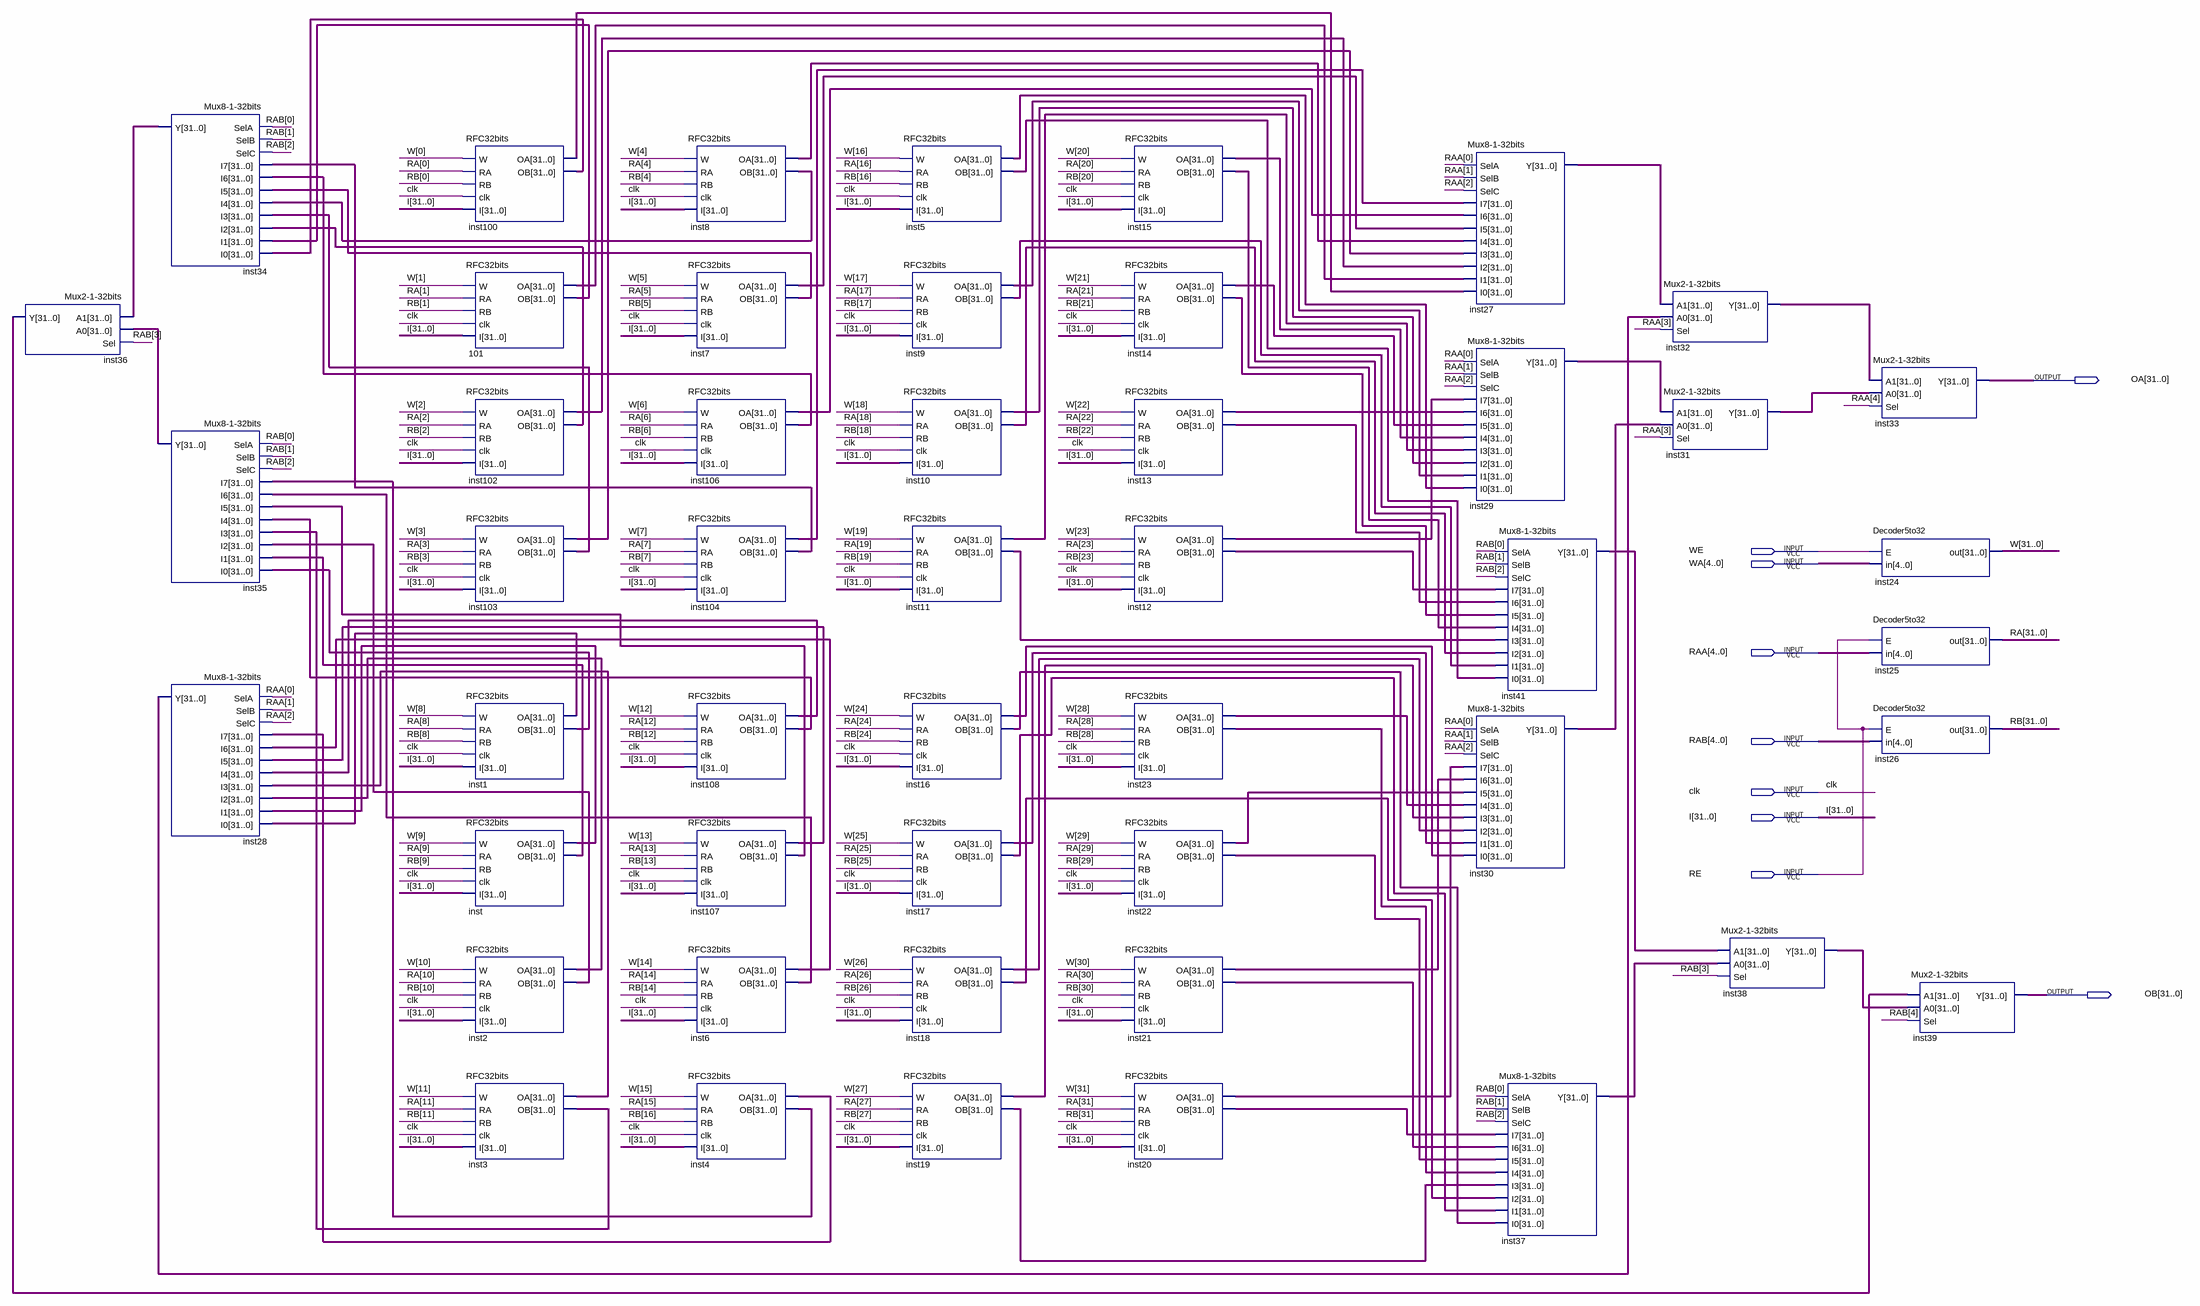
[diagram p0: schematic sheet]
// Quartus schematic RF32-32(test).bdf as structural Verilog: 49 symbols, 9 pins
module \RF32-32(test)  (
  input  WE,
  input  [4:0] WA,
  input  [4:0] RAA,
  input  [4:0] RAB,
  input  clk,
  input  [31:0] I,
  input  RE,
  output [31:0] OA,
  output [31:0] OB
);

  wire [31:0] inst1_oa, inst1_ob, inst2_oa, inst2_ob, inst3_oa, inst3_ob, inst4_oa, inst4_ob, inst5_oa,
       inst5_ob, inst6_oa, inst6_ob, inst7_oa, inst7_ob, inst8_oa, inst8_ob, inst9_oa, inst9_ob, inst10_oa,
       inst10_ob, inst11_oa, inst11_ob, inst12_oa, inst12_ob, inst13_oa, inst13_ob, inst14_oa, inst14_ob,
       inst15_oa, inst15_ob, inst16_oa, inst16_ob, inst17_oa, inst17_ob, inst18_oa, inst18_ob, inst19_oa,
       inst19_ob, inst20_oa, inst20_ob, inst21_oa, inst21_ob, inst22_oa, inst22_ob, inst23_oa, inst23_ob,
       inst27_y, inst28_y, inst29_y, inst30_y, inst31_y, inst32_y, inst34_y, inst35_y, inst36_y, inst37_y,
       inst38_y, inst41_y, inst100_oa, inst100_ob, inst102_oa, inst102_ob, inst103_oa, inst103_ob,
       inst104_oa, inst104_ob, inst106_oa, inst106_ob, inst107_oa, inst107_ob, inst108_oa, inst108_ob,
       inst_oa, inst_ob, n101_oa, n101_ob, RA, RB, W;

  \Mux2-1-32bits  inst36 (.A1(inst34_y), .A0(inst35_y), .Sel(RAB[3]), .Y(inst36_y));
  \Mux8-1-32bits  inst34 (
    .SelA(RAB[0]), .SelB(RAB[1]), .SelC(RAB[2]), .I7(inst104_ob), .I6(inst106_ob), .I5(inst7_ob),
    .I4(inst8_ob), .I3(inst103_ob), .I2(inst102_ob), .I1(n101_ob), .I0(inst100_ob), .Y(inst34_y));
  \Mux8-1-32bits  inst35 (
    .SelA(RAB[0]), .SelB(RAB[1]), .SelC(RAB[2]), .I7(inst4_ob), .I6(inst6_ob), .I5(inst107_ob),
    .I4(inst108_ob), .I3(inst3_ob), .I2(inst2_ob), .I1(inst_ob), .I0(inst1_ob), .Y(inst35_y));
  \Mux8-1-32bits  inst28 (
    .SelA(RAA[0]), .SelB(RAA[1]), .SelC(RAA[2]), .I7(inst4_oa), .I6(inst6_oa), .I5(inst107_oa),
    .I4(inst108_oa), .I3(inst3_oa), .I2(inst2_oa), .I1(inst_oa), .I0(inst1_oa), .Y(inst28_y));
  RFC32bits inst100 (.W(W[0]), .RA(RA[0]), .RB(RB[0]), .clk(clk), .I(I), .OA(inst100_oa), .OB(inst100_ob));
  RFC32bits u_101 (.W(W[1]), .RA(RA[1]), .RB(RB[1]), .clk(clk), .I(I), .OA(n101_oa), .OB(n101_ob));
  RFC32bits inst102 (.W(W[2]), .RA(RA[2]), .RB(RB[2]), .clk(clk), .I(I), .OA(inst102_oa), .OB(inst102_ob));
  RFC32bits inst103 (.W(W[3]), .RA(RA[3]), .RB(RB[3]), .clk(clk), .I(I), .OA(inst103_oa), .OB(inst103_ob));
  RFC32bits inst1 (.W(W[8]), .RA(RA[8]), .RB(RB[8]), .clk(clk), .I(I), .OA(inst1_oa), .OB(inst1_ob));
  RFC32bits inst (.W(W[9]), .RA(RA[9]), .RB(RB[9]), .clk(clk), .I(I), .OA(inst_oa), .OB(inst_ob));
  RFC32bits inst2 (.W(W[10]), .RA(RA[10]), .RB(RB[10]), .clk(clk), .I(I), .OA(inst2_oa), .OB(inst2_ob));
  RFC32bits inst3 (.W(W[11]), .RA(RA[11]), .RB(RB[11]), .clk(clk), .I(I), .OA(inst3_oa), .OB(inst3_ob));
  RFC32bits inst8 (.W(W[4]), .RA(RA[4]), .RB(RB[4]), .clk(clk), .I(I), .OA(inst8_oa), .OB(inst8_ob));
  RFC32bits inst7 (.W(W[5]), .RA(RA[5]), .RB(RB[5]), .clk(clk), .I(I), .OA(inst7_oa), .OB(inst7_ob));
  RFC32bits inst106 (.W(W[6]), .RA(RA[6]), .RB(RB[6]), .clk(clk), .I(I), .OA(inst106_oa), .OB(inst106_ob));
  RFC32bits inst104 (.W(W[7]), .RA(RA[7]), .RB(RB[7]), .clk(clk), .I(I), .OA(inst104_oa), .OB(inst104_ob));
  RFC32bits inst108 (.W(W[12]), .RA(RA[12]), .RB(RB[12]), .clk(clk), .I(I), .OA(inst108_oa), .OB(inst108_ob));
  RFC32bits inst107 (.W(W[13]), .RA(RA[13]), .RB(RB[13]), .clk(clk), .I(I), .OA(inst107_oa), .OB(inst107_ob));
  RFC32bits inst6 (.W(W[14]), .RA(RA[14]), .RB(RB[14]), .clk(clk), .I(I), .OA(inst6_oa), .OB(inst6_ob));
  RFC32bits inst4 (.W(W[15]), .RA(RA[15]), .RB(RB[16]), .clk(clk), .I(I), .OA(inst4_oa), .OB(inst4_ob));
  RFC32bits inst5 (.W(W[16]), .RA(RA[16]), .RB(RB[16]), .clk(clk), .I(I), .OA(inst5_oa), .OB(inst5_ob));
  RFC32bits inst9 (.W(W[17]), .RA(RA[17]), .RB(RB[17]), .clk(clk), .I(I), .OA(inst9_oa), .OB(inst9_ob));
  RFC32bits inst10 (.W(W[18]), .RA(RA[18]), .RB(RB[18]), .clk(clk), .I(I), .OA(inst10_oa), .OB(inst10_ob));
  RFC32bits inst11 (.W(W[19]), .RA(RA[19]), .RB(RB[19]), .clk(clk), .I(I), .OA(inst11_oa), .OB(inst11_ob));
  RFC32bits inst16 (.W(W[24]), .RA(RA[24]), .RB(RB[24]), .clk(clk), .I(I), .OA(inst16_oa), .OB(inst16_ob));
  RFC32bits inst17 (.W(W[25]), .RA(RA[25]), .RB(RB[25]), .clk(clk), .I(I), .OA(inst17_oa), .OB(inst17_ob));
  RFC32bits inst18 (.W(W[26]), .RA(RA[26]), .RB(RB[26]), .clk(clk), .I(I), .OA(inst18_oa), .OB(inst18_ob));
  RFC32bits inst19 (.W(W[27]), .RA(RA[27]), .RB(RB[27]), .clk(clk), .I(I), .OA(inst19_oa), .OB(inst19_ob));
  RFC32bits inst15 (.W(W[20]), .RA(RA[20]), .RB(RB[20]), .clk(clk), .I(I), .OA(inst15_oa), .OB(inst15_ob));
  RFC32bits inst14 (.W(W[21]), .RA(RA[21]), .RB(RB[21]), .clk(clk), .I(I), .OA(inst14_oa), .OB(inst14_ob));
  RFC32bits inst13 (.W(W[22]), .RA(RA[22]), .RB(RB[22]), .clk(clk), .I(I), .OA(inst13_oa), .OB(inst13_ob));
  RFC32bits inst12 (.W(W[23]), .RA(RA[23]), .RB(RB[23]), .clk(clk), .I(I), .OA(inst12_oa), .OB(inst12_ob));
  RFC32bits inst23 (.W(W[28]), .RA(RA[28]), .RB(RB[28]), .clk(clk), .I(I), .OA(inst23_oa), .OB(inst23_ob));
  RFC32bits inst22 (.W(W[29]), .RA(RA[29]), .RB(RB[29]), .clk(clk), .I(I), .OA(inst22_oa), .OB(inst22_ob));
  RFC32bits inst21 (.W(W[30]), .RA(RA[30]), .RB(RB[30]), .clk(clk), .I(I), .OA(inst21_oa), .OB(inst21_ob));
  RFC32bits inst20 (.W(W[31]), .RA(RA[31]), .RB(RB[31]), .clk(clk), .I(I), .OA(inst20_oa), .OB(inst20_ob));
  \Mux8-1-32bits  inst27 (
    .SelA(RAA[0]), .SelB(RAA[1]), .SelC(RAA[2]), .I7(inst104_oa), .I6(inst106_oa), .I5(inst7_oa),
    .I4(inst8_oa), .I3(inst103_oa), .I2(inst102_oa), .I1(n101_oa), .I0(inst100_oa), .Y(inst27_y));
  \Mux8-1-32bits  inst29 (
    .SelA(RAA[0]), .SelB(RAA[1]), .SelC(RAA[2]), .I7(inst12_oa), .I6(inst13_oa), .I5(inst14_oa),
    .I4(inst15_oa), .I3(inst11_oa), .I2(inst10_oa), .I1(inst9_oa), .I0(inst5_oa), .Y(inst29_y));
  \Mux8-1-32bits  inst41 (
    .SelA(RAB[0]), .SelB(RAB[1]), .SelC(RAB[2]), .I7(inst12_ob), .I6(inst13_ob), .I5(inst14_ob),
    .I4(inst15_ob), .I3(inst11_ob), .I2(inst10_ob), .I1(inst9_ob), .I0(inst5_ob), .Y(inst41_y));
  \Mux8-1-32bits  inst30 (
    .SelA(RAA[0]), .SelB(RAA[1]), .SelC(RAA[2]), .I7(inst20_oa), .I6(inst21_oa), .I5(inst22_oa),
    .I4(inst23_oa), .I3(inst19_oa), .I2(inst18_oa), .I1(inst17_oa), .I0(inst16_oa), .Y(inst30_y));
  \Mux8-1-32bits  inst37 (
    .SelA(RAB[0]), .SelB(RAB[1]), .SelC(RAB[2]), .I7(inst20_ob), .I6(inst21_ob), .I5(inst22_ob),
    .I4(inst23_ob), .I3(inst19_ob), .I2(inst18_ob), .I1(inst17_ob), .I0(inst16_ob), .Y(inst37_y));
  \Mux2-1-32bits  inst32 (.A1(inst27_y), .A0(inst28_y), .Sel(RAA[3]), .Y(inst32_y));
  \Mux2-1-32bits  inst31 (.A1(inst29_y), .A0(inst30_y), .Sel(RAA[3]), .Y(inst31_y));
  \Mux2-1-32bits  inst38 (.A1(inst41_y), .A0(inst37_y), .Sel(RAB[3]), .Y(inst38_y));
  \Mux2-1-32bits  inst33 (.A1(inst32_y), .A0(inst31_y), .Sel(RAA[4]), .Y(OA));
  Decoder5to32 inst24 (.E(WE), .in(WA), .out(W));
  Decoder5to32 inst25 (.E(RE), .in(RAA), .out(RA));
  Decoder5to32 inst26 (.E(RE), .in(RAB), .out(RB));
  \Mux2-1-32bits  inst39 (.A1(inst36_y), .A0(inst38_y), .Sel(RAB[4]), .Y(OB));
endmodule
